# Altium project DEVEFX000001A.PrjPcb (part 2 of 2)

## Sheet 18_PWR_INPUT.SchDoc
size A3; DocumentNumber: 18; SheetNumber: 18; SheetTotal: 21
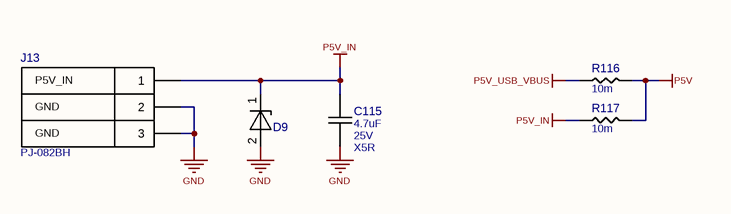
[diagram p17: 18_PWR_INPUT.SchDoc]

### Parts
C115  4.7uF  Voltage: 25V  TempC: X5R  [CAPC1608X08N]
D9  ESD401DPYR  [DFN65P100X50-2N]  (value not drawn)
J13  PJ-082BH  [CUI_PJ-082BH]
R116  10m  [RESC2012X06N]
R117  10m  [RESC2012X06N]

### Nets
GND: C115.1 D9.2(A) J13.2 J13.3
P5V: R116.2 R117.2
P5V_IN: C115.2 D9.1(C) J13.1 R117.1
P5V_USB_VBUS: R116.1

### Notes on the sheet
- P5V_IN
- GND

### Library data of the parts
C115 = GRM188R61E475KE11D: CAP CER 4.7UF 25V X5R 0603; Manufacturer 1: Murata Electronics; Tol: 10%; Part Number: GRM188R61E475KE11D; Value: 4.7uF; Manufacturer Part Number 1: GRM188R61E475KE11D; Supplier 1: Digi-Key; Supplier Part Number 1: 490-7203-1-ND
D9 = ESD401DPYR: TVS DIODE 5.5V 24V 2X1SON; Manufacturer 1: Texas Instruments; Part Number: ESD401DPYR; Manufacturer Part Number 1: ESD401DPYR; Supplier 1: Digi-Key; Supplier Part Number 1: 296-47160-1-ND
J13 = PJ-082BH: CONN PWR JACK 2.5X5.5MM SOLDER; Manufacturer 1: CUI Devices; Part Number: PJ-082BH; Manufacturer Part Number 1: PJ-082BH; Supplier 1: Digi-Key; Supplier Part Number 1: CP-082BHTR-ND
R116 R117 = PF0805FRM7W0R01L: RES 0.01 OHM 1% 1/4W 0805; Manufacturer 1: Yageo; Part Number: PF0805FRM7W0R01L; Value: 10m; Tol: 1%; Manufacturer Part Number 1: PF0805FRM7W0R01L; Supplier 1: Digi-Key; Supplier Part Number 1: 311-0.01NUCT-ND

## Sheet 19_PWR_VRS.SchDoc
size A3; DocumentNumber: 19; SheetNumber: 19; SheetTotal: 21
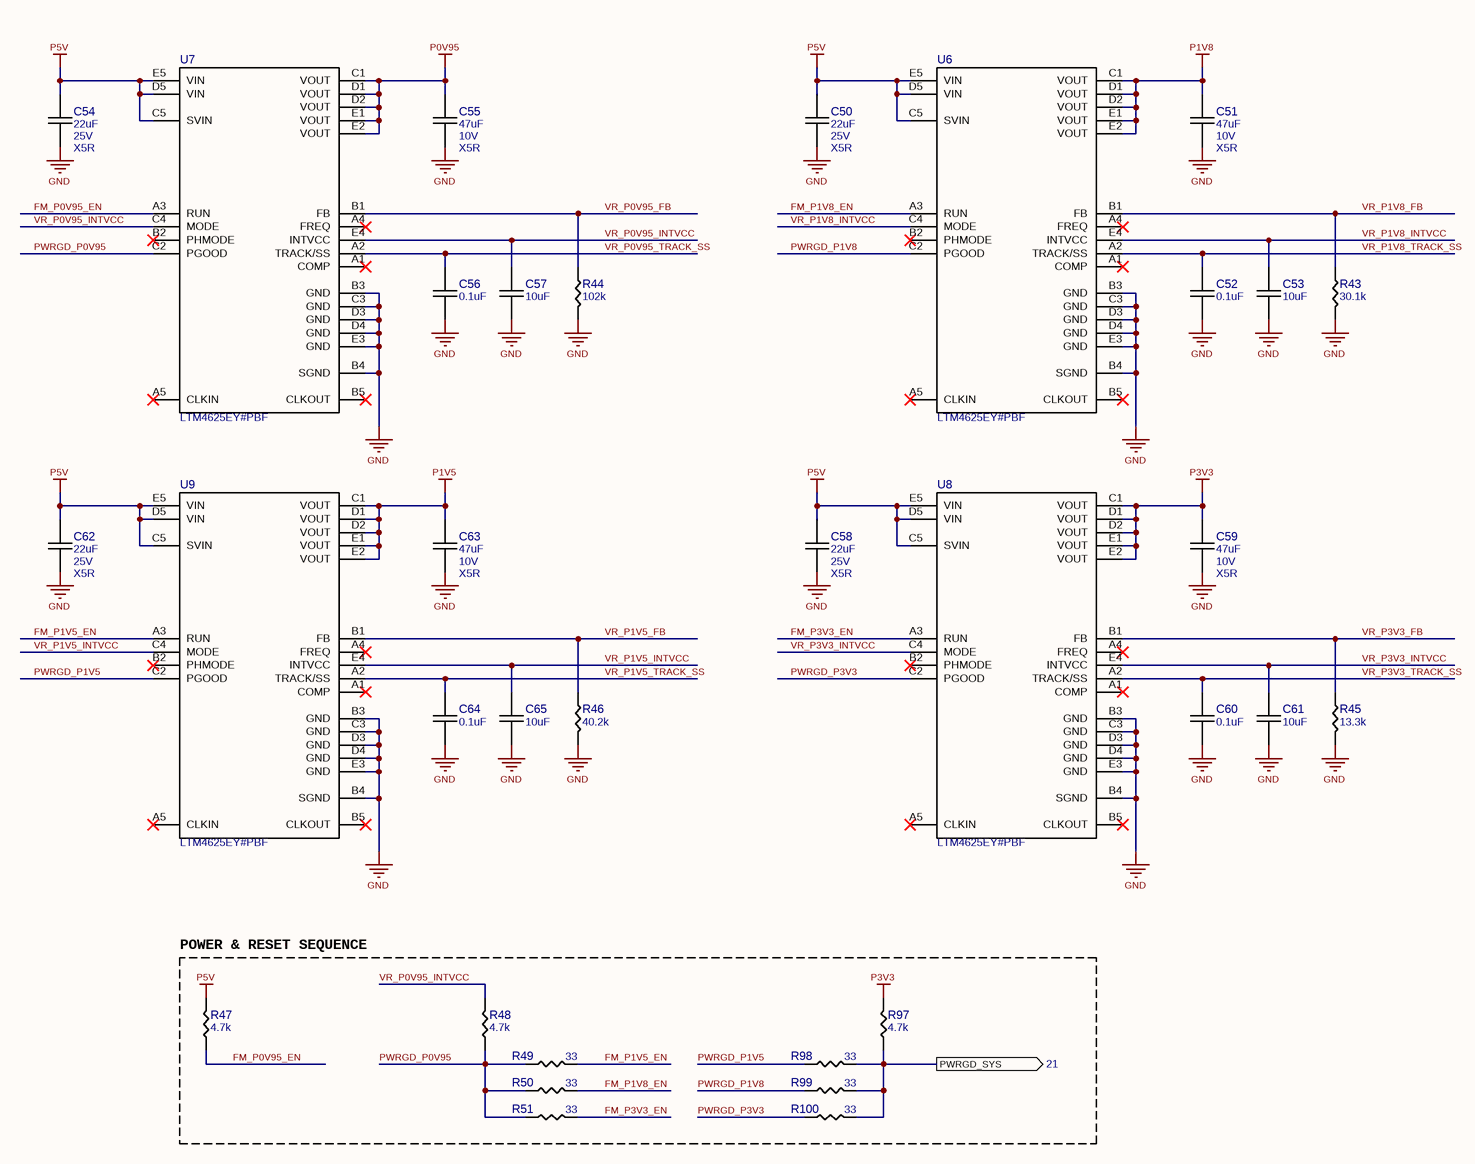
[diagram p18: 19_PWR_VRS.SchDoc]

### Parts
C50  22uF  Voltage: 25V  TempC: X5R  [CAPC2012X14N]
C51  47uF  Voltage: 10V  TempC: X5R  [CAPC2012X14N]
C52  0.1uF  [CAPC1005X06N]
C53  10uF  [CAPC1005X06N]
C54  22uF  Voltage: 25V  TempC: X5R  [CAPC2012X14N]
C55  47uF  Voltage: 10V  TempC: X5R  [CAPC2012X14N]
C56  0.1uF  [CAPC1005X06N]
C57  10uF  [CAPC1005X06N]
C58  22uF  Voltage: 25V  TempC: X5R  [CAPC2012X14N]
C59  47uF  Voltage: 10V  TempC: X5R  [CAPC2012X14N]
C60  0.1uF  [CAPC1005X06N]
C61  10uF  [CAPC1005X06N]
C62  22uF  Voltage: 25V  TempC: X5R  [CAPC2012X14N]
C63  47uF  Voltage: 10V  TempC: X5R  [CAPC2012X14N]
C64  0.1uF  [CAPC1005X06N]
C65  10uF  [CAPC1005X06N]
R43  30.1k  [RESC1005X03N]
R44  102k  [RESC1005X03N]
R45  13.3k  [RESC1005X03N]
R46  40.2k  [RESC1005X03N]
R47  4.7k  [RESC1005X03N]
R48  4.7k  [RESC1005X03N]
R49  33  [RESC1005X03N]
R50  33  [RESC1005X03N]
R51  33  [RESC1005X03N]
R97  4.7k  [RESC1005X03N]
R98  33  [RESC1005X03N]
R99  33  [RESC1005X03N]
R100  33  [RESC1005X03N]
U6  LTM4625EY#PBF  [BGA25C127P5X5_625X625X521]
U7  LTM4625EY#PBF  [BGA25C127P5X5_625X625X521]
U8  LTM4625EY#PBF  [BGA25C127P5X5_625X625X521]
U9  LTM4625EY#PBF  [BGA25C127P5X5_625X625X521]

### Blocks framed on the sheet
POWER & RESET SEQUENCE: R47-R51 R97-R100

### Ports
PWRGD_SYS (out, see 21)

### Nets
GND: C50.1 C51.1 C52.1 C53.1 C54.1 C55.1 C56.1 C57.1 C58.1 C59.1 C60.1 C61.1 C62.1 C63.1 C64.1 C65.1 R43.2 R44.2 R45.2 R46.2 U6.B3(GND) U6.B4(SGND) U6.C3(GND) U6.D3(GND) U6.D4(GND) U6.E3(GND) U7.B3(GND) U7.B4(SGND) U7.C3(GND) U7.D3(GND) U7.D4(GND) U7.E3(GND) U8.B3(GND) U8.B4(SGND) U8.C3(GND) U8.D3(GND) U8.D4(GND) U8.E3(GND) U9.B3(GND) U9.B4(SGND) U9.C3(GND) U9.D3(GND) U9.D4(GND) U9.E3(GND)
P0V95: C55.2 U7.C1(VOUT) U7.D1(VOUT) U7.D2(VOUT) U7.E1(VOUT) U7.E2(VOUT)
P1V5: C63.2 U9.C1(VOUT) U9.D1(VOUT) U9.D2(VOUT) U9.E1(VOUT) U9.E2(VOUT)
P1V8: C51.2 U6.C1(VOUT) U6.D1(VOUT) U6.D2(VOUT) U6.E1(VOUT) U6.E2(VOUT)
P3V3: C59.2 R97.2 U8.C1(VOUT) U8.D1(VOUT) U8.D2(VOUT) U8.E1(VOUT) U8.E2(VOUT)
P5V: C50.2 C54.2 C58.2 C62.2 R47.2 U6.C5(SVIN) U6.D5(VIN) U6.E5(VIN) U7.C5(SVIN) U7.D5(VIN) U7.E5(VIN) U8.C5(SVIN) U8.D5(VIN) U8.E5(VIN) U9.C5(SVIN) U9.D5(VIN) U9.E5(VIN)
FM_P0V95_EN: R47.1 U7.A3(RUN)
FM_P1V5_EN: R49.2 U9.A3(RUN)
FM_P1V8_EN: R50.2 U6.A3(RUN)
FM_P3V3_EN: R51.2 U8.A3(RUN)
PWRGD_P0V95: R48.1 R49.1 R50.1 R51.1 U7.C2(PGOOD)
PWRGD_P1V5: R98.1 U9.C2(PGOOD)
PWRGD_P1V8: R99.1 U6.C2(PGOOD)
PWRGD_P3V3: R100.1 U8.C2(PGOOD)
PWRGD_SYS: R97.1 R98.2 R99.2 R100.2 ; port PWRGD_SYS
VR_P0V95_FB: R44.1 U7.B1(FB)
VR_P0V95_INTVCC: C57.2 R48.2 U7.C4(MODE) U7.E4(INTVCC)
VR_P0V95_TRACK_SS: C56.2 U7.A2(TRACK/SS)
VR_P1V5_FB: R46.1 U9.B1(FB)
VR_P1V5_INTVCC: C65.2 U9.C4(MODE) U9.E4(INTVCC)
VR_P1V5_TRACK_SS: C64.2 U9.A2(TRACK/SS)
VR_P1V8_FB: R43.1 U6.B1(FB)
VR_P1V8_INTVCC: C53.2 U6.C4(MODE) U6.E4(INTVCC)
VR_P1V8_TRACK_SS: C52.2 U6.A2(TRACK/SS)
VR_P3V3_FB: R45.1 U8.B1(FB)
VR_P3V3_INTVCC: C61.2 U8.C4(MODE) U8.E4(INTVCC)
VR_P3V3_TRACK_SS: C60.2 U8.A2(TRACK/SS)

Not connected (* = marked no-connect by the designer): U6 A1(COMP)* A4(FREQ)* A5(CLKIN)* B2(PHMODE)* B5(CLKOUT)*; U7 A1(COMP)* A4(FREQ)* A5(CLKIN)* B2(PHMODE)* B5(CLKOUT)*; U8 A1(COMP)* A4(FREQ)* A5(CLKIN)* B2(PHMODE)* B5(CLKOUT)*; U9 A1(COMP)* A4(FREQ)* A5(CLKIN)* B2(PHMODE)* B5(CLKOUT)*

### Library data of the parts
C50 C54 C58 C62 = GRM21BR61E226ME44L: CAP CER 22UF 25V X5R 0805; Manufacturer 1: Murata Electronics; Tol: 20%; Part Number: GRM21BR61E226ME44L; Value: 22uF; Manufacturer Part Number 1: GRM21BR61E226ME44L; Supplier 1: Digi-Key; Supplier Part Number 1: 490-10749-1-ND
C51 C55 C59 C63 = GRM21BR61A476ME15L: CAP CER 47UF 10V X5R 0805; Manufacturer 1: Murata Electronics; Tol: 20%; Part Number: GRM21BR61A476ME15L; Value: 47uF; Manufacturer Part Number 1: GRM21BR61A476ME15L; Supplier 1: Digi-Key; Supplier Part Number 1: 490-9961-1-ND
C52 C56 C60 C64 = GRM155R71E104KE14J: as C25 on sheet 13_IO_ETH; Part Number: GRM155R71E104KE14J; Value: 0.1uF; Voltage: 25V; TempC: X7R; Manufacturer Part Number 1: GRM155R71E104KE14J; Supplier 1: Digi-Key; Supplier Part Number 1: 490-14603-1-ND
C53 C57 C61 C65 = GRM155R60J106ME47D: CAP CER 10UF 6.3V X5R 0402; Manufacturer 1: Murata Electronics; Tol: 20%; Part Number: GRM155R60J106ME47D; Value: 10uF; Voltage: 6.3V; TempC: X5R; Manufacturer Part Number 1: GRM155R60J106ME47D; Supplier 1: Digi-Key; Supplier Part Number 1: 490-13239-1-ND
R43 = RC0402FR-0730K1L: RES 30.1K OHM 1% 1/16W 0402; Manufacturer 1: Yageo; Part Number: RC0402FR-0730K1L; Value: 30.1k; Tol: 1%; Manufacturer Part Number 1: RC0402FR-0730K1L; Supplier 1: Digi-Key; Supplier Part Number 1: 311-30.1KLRCT-ND
R44 = RC0402FR-07102KL: RES SMD 102K OHM 1% 1/16W 0402; Manufacturer 1: Yageo; Part Number: RC0402FR-07102KL; Value: 102k; Tol: 1%; Manufacturer Part Number 1: RC0402FR-07102KL; Supplier 1: Digi-Key; Supplier Part Number 1: YAG2944CT-ND
R45 = RC0402FR-0713K3L: RES 13.3K OHM 1% 1/16W 0402; Manufacturer 1: Yageo; Part Number: RC0402FR-0713K3L; Value: 13.3k; Tol: 1%; Manufacturer Part Number 1: RC0402FR-0713K3L; Supplier 1: Digi-Key; Supplier Part Number 1: YAG2974CT-ND
R46 = RC0402FR-0740K2L: RES 40.2K OHM 1% 1/16W 0402; Manufacturer 1: Yageo; Part Number: RC0402FR-0740K2L; Value: 40.2k; Tol: 1%; Manufacturer Part Number 1: RC0402FR-0740K2L; Supplier 1: Digi-Key; Supplier Part Number 1: 311-40.2KLRCT-ND
R47 R48 R97 = RC0402FR-074K7L: as R55 on sheet 12_MEM_DDR3; Part Number: RC0402FR-074K7L; Value: 4.7k; Tol: 1%; Manufacturer Part Number 1: RC0402FR-074K7L; Supplier 1: Digi-Key; Supplier Part Number 1: 311-4.7KLRCT-ND
R49-R51 R98-R100 = RC0402FR-0733RL: as R62 on sheet 05_FPGA_HVIO; Part Number: RC0402FR-0733RL; Value: 33; Tol: 1%; Manufacturer Part Number 1: RC0402FR-0733RL; Supplier 1: Digi-Key; Supplier Part Number 1: 311-33.0LRCT-ND
U6-U9 = LTM4625EY#PBF: DC DC CONVERTER 0.6-5.5V; Manufacturer 1: Analog Devices Inc.; Part Number: LTM4625EY#PBF; Manufacturer Part Number 1: LTM4625EY#PBF; Supplier 1: Digi-Key; Supplier Part Number 1: 505-LTM4625EY#PBF-ND

## Sheet 20_CLOCKS.SchDoc
size A3; DocumentNumber: 20; SheetNumber: 20; SheetTotal: 21
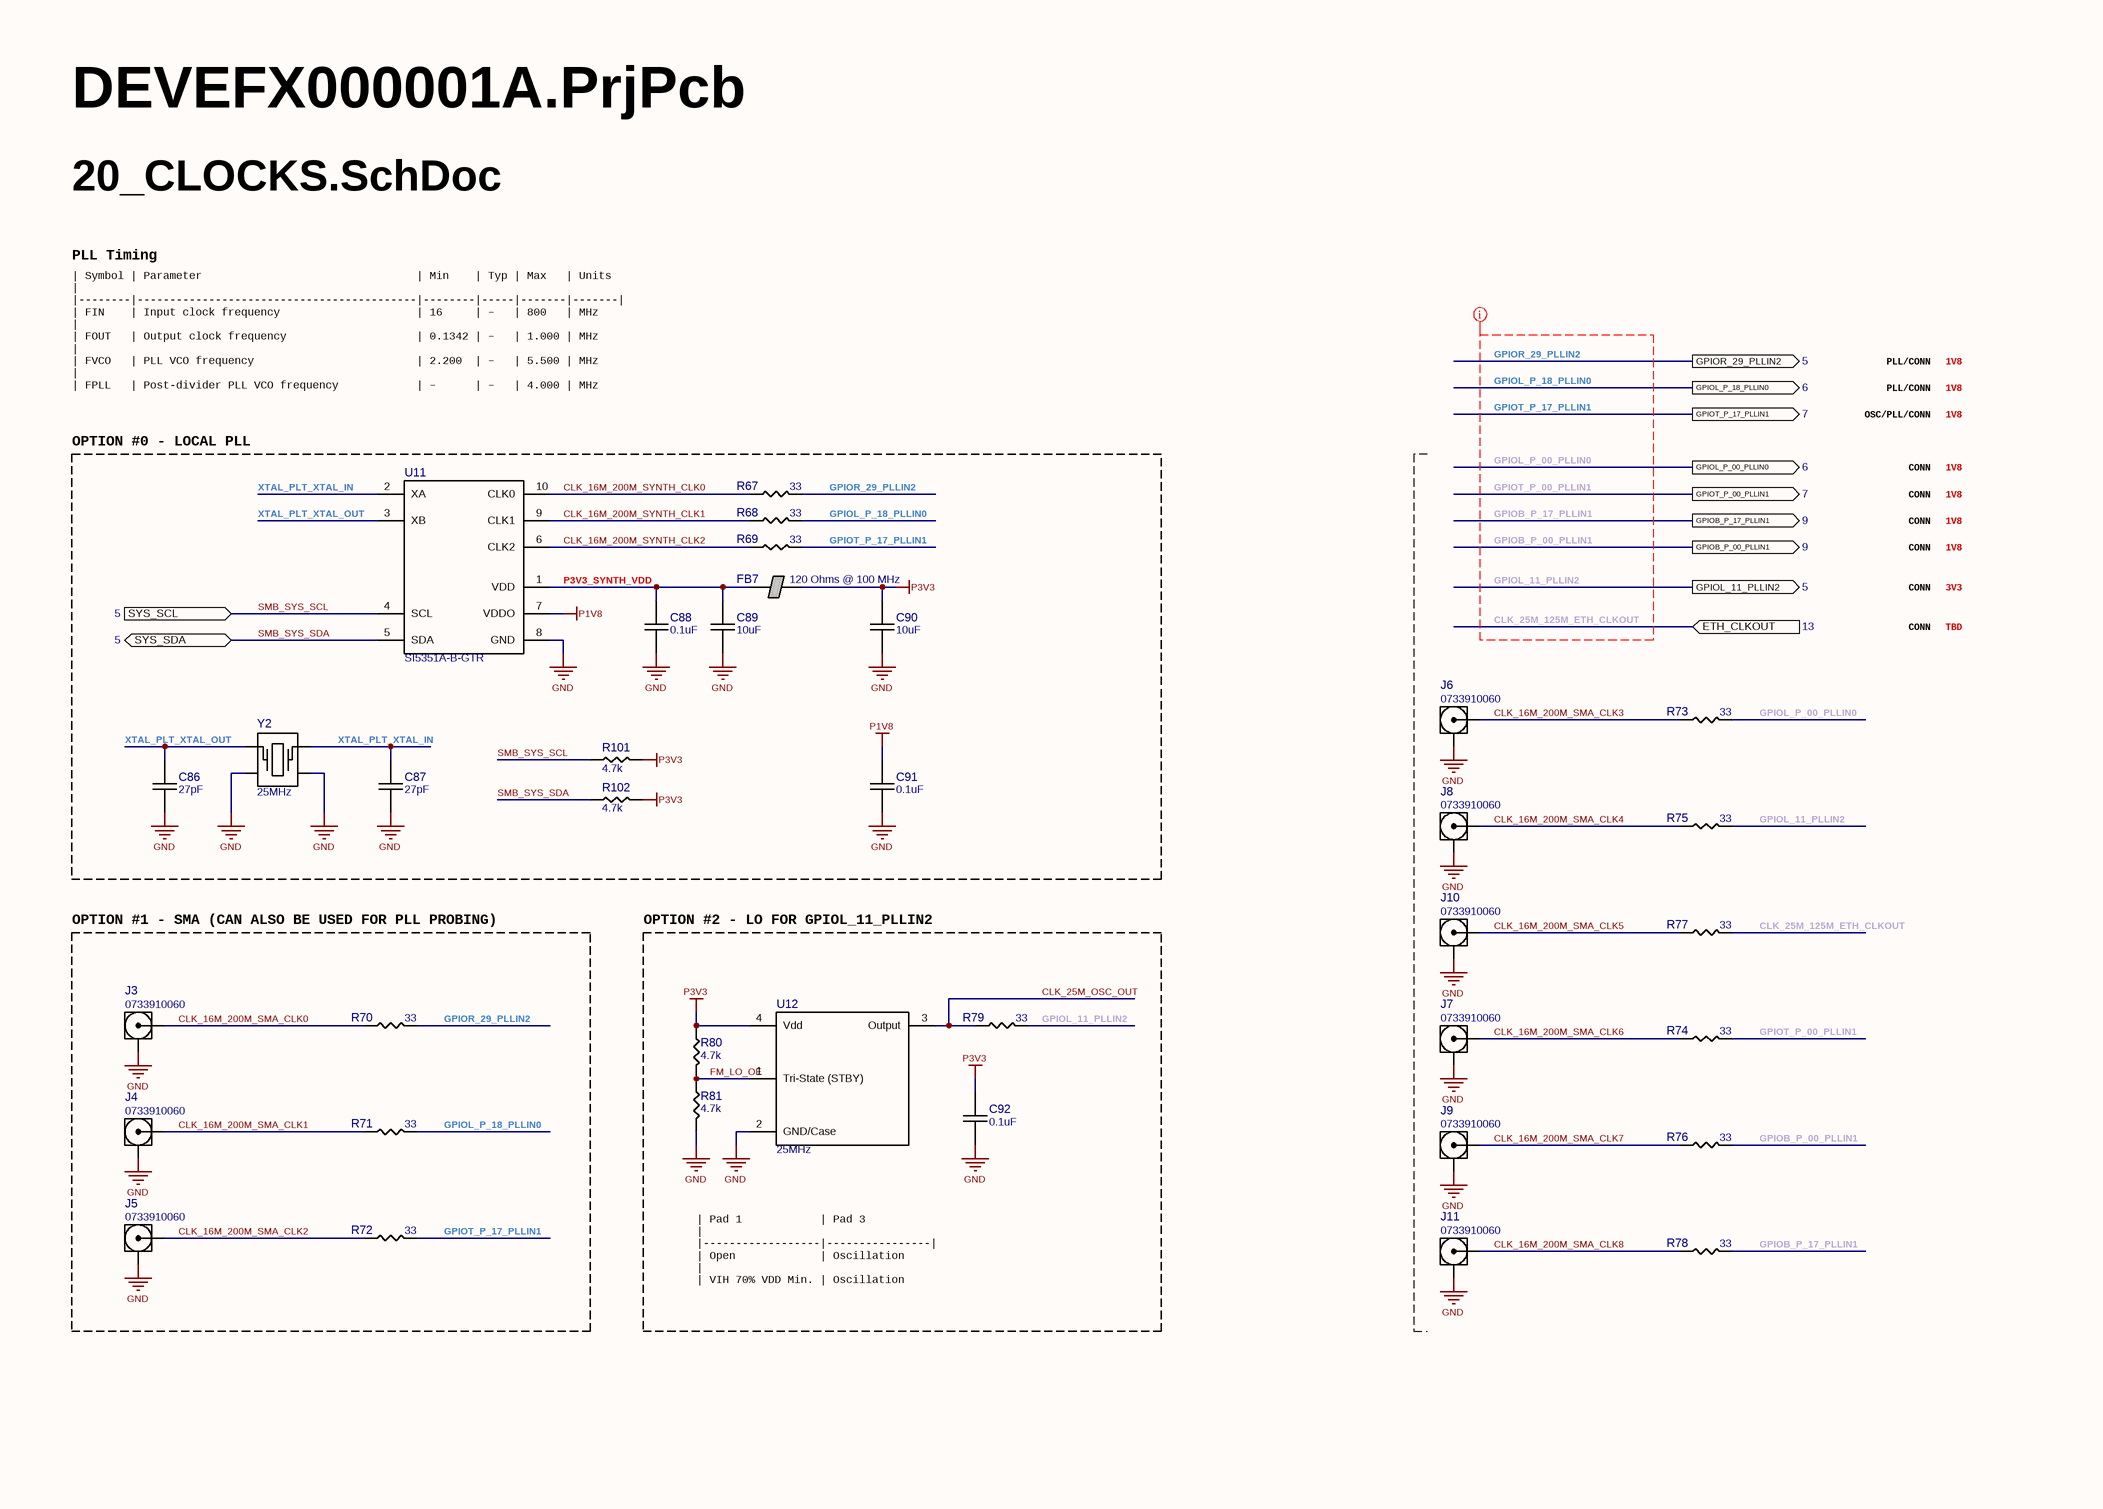
[diagram p19: 20_CLOCKS.SchDoc]

### Parts
C86  27pF  [CAPC1005X06N]
C87  27pF  [CAPC1005X06N]
C88  0.1uF  [CAPC1005X06N]
C89  10uF  [CAPC1005X06N]
C90  10uF  [CAPC1005X06N]
C91  0.1uF  [CAPC1005X06N]
C92  0.1uF  [CAPC1005X06N]
FB7  120 Ohms @ 100 MHz  [INDC1005X05N]
J3  0733910060  [MOLEX_0733910060]
J4  0733910060  [MOLEX_0733910060]
J5  0733910060  [MOLEX_0733910060]
J6  0733910060  [MOLEX_0733910060]
J7  0733910060  [MOLEX_0733910060]
J8  0733910060  [MOLEX_0733910060]
J9  0733910060  [MOLEX_0733910060]
J10  0733910060  [MOLEX_0733910060]
J11  0733910060  [MOLEX_0733910060]
R67  33  [RESC1005X03N]
R68  33  [RESC1005X03N]
R69  33  [RESC1005X03N]
R70  33  [RESC1005X03N]
R71  33  [RESC1005X03N]
R72  33  [RESC1005X03N]
R73  33  [RESC1005X03N]
R74  33  [RESC1005X03N]
R75  33  [RESC1005X03N]
R76  33  [RESC1005X03N]
R77  33  [RESC1005X03N]
R78  33  [RESC1005X03N]
R79  33  [RESC1005X03N]
R80  4.7k  [RESC1005X03N]
R81  4.7k  [RESC1005X03N]
R101  4.7k  [RESC1005X03N]
R102  4.7k  [RESC1005X03N]
U11  SI5351A-B-GTR  [TSSOP50P490X110-10N]
U12  25MHz  [XTAL_2520]
Y2  25MHz  [XTAL_3225]

### Blocks framed on the sheet
OPTION #0 - LOCAL PLL: C86-C91 FB7 R67-R69 R101 R102 U11 Y2
OPTION #1 - SMA (CAN ALSO BE USED FOR PLL PROBING): J3-J5 R70-R72
OPTION #2 - LO FOR GPIOL_11_PLLIN2: C92 R79-R81 U12

### Ports
ETH_CLKOUT (in, see 13), GPIOB_P_00_PLLIN1 (out, see 9), GPIOB_P_17_PLLIN1 (out, see 9), GPIOL_11_PLLIN2 (out, see 5), GPIOL_P_00_PLLIN0 (out, see 6), GPIOL_P_18_PLLIN0 (out, see 6), GPIOR_29_PLLIN2 (out, see 5), GPIOT_P_00_PLLIN1 (out, see 7), GPIOT_P_17_PLLIN1 (out, see 7), SYS_SCL (in, see 5), SYS_SDA (bidir, see 5)

### Nets
GND: C86.1 C87.1 C88.1 C89.1 C90.1 C91.1 C92.1 J3.2 J4.2 J5.2 J6.2 J7.2 J8.2 J9.2 J10.2 J11.2 R81.2 U11.8(GND) U12.2(GND/Case) Y2.2 Y2.4
P1V8: C91.2 U11.7(VDDO)
P3V3: C90.2 C92.2 FB7.2 R80.1 R101.2 R102.2 U12.4(Vdd)
CLK_16M_200M_SMA_CLK0: J3.1 R70.1
CLK_16M_200M_SMA_CLK1: J4.1 R71.1
CLK_16M_200M_SMA_CLK2: J5.1 R72.1
CLK_16M_200M_SMA_CLK3: J6.1 R73.1
CLK_16M_200M_SMA_CLK4: J8.1 R75.1
CLK_16M_200M_SMA_CLK5: J10.1 R77.1
CLK_16M_200M_SMA_CLK6: J7.1 R74.1
CLK_16M_200M_SMA_CLK7: J9.1 R76.1
CLK_16M_200M_SMA_CLK8: J11.1 R78.1
CLK_16M_200M_SYNTH_CLK0: R67.1 U11.10(CLK0)
CLK_16M_200M_SYNTH_CLK1: R68.1 U11.9(CLK1)
CLK_16M_200M_SYNTH_CLK2: R69.1 U11.6(CLK2)
CLK_25M_125M_ETH_CLKOUT: R77.2 ; port ETH_CLKOUT
CLK_25M_OSC_OUT: R79.1 U12.3(Output)
FM_LO_OE: R80.2 R81.1 U12.1(Tri-State_(STBY))
GPIOB_P_00_PLLIN1: R76.2 ; port GPIOB_P_00_PLLIN1
GPIOB_P_17_PLLIN1: R78.2 ; port GPIOB_P_17_PLLIN1
GPIOL_11_PLLIN2: R75.2 R79.2 ; port GPIOL_11_PLLIN2
GPIOL_P_00_PLLIN0: R73.2 ; port GPIOL_P_00_PLLIN0
GPIOL_P_18_PLLIN0: R68.2 R71.2 ; port GPIOL_P_18_PLLIN0
GPIOR_29_PLLIN2: R67.2 R70.2 ; port GPIOR_29_PLLIN2
GPIOT_P_00_PLLIN1: R74.2 ; port GPIOT_P_00_PLLIN1
GPIOT_P_17_PLLIN1: R69.2 R72.2 ; port GPIOT_P_17_PLLIN1
P3V3_SYNTH_VDD: C88.2 C89.2 FB7.1 U11.1(VDD)
SMB_SYS_SCL: R101.1 U11.4(SCL) ; port SYS_SCL
SMB_SYS_SDA: R102.1 U11.5(SDA) ; port SYS_SDA
XTAL_PLT_XTAL_IN: C87.2 U11.2(XA) Y2.3
XTAL_PLT_XTAL_OUT: C86.2 U11.3(XB) Y2.1

### Layout directives
net class CLK: CLK_25M_125M_ETH_CLKOUT, GPIOB_P_00_PLLIN1, GPIOB_P_17_PLLIN1, GPIOL_11_PLLIN2, GPIOL_P_00_PLLIN0, GPIOL_P_18_PLLIN0, GPIOR_29_PLLIN2, GPIOT_P_00_PLLIN1, GPIOT_P_17_PLLIN1

### Notes on the sheet
- PLL Timing
- | Symbol | Parameter                                 | Min    | Typ | Max   | Units |
  |--------|-------------------------------------------|--------|-----|-------|-------|
  | FIN    | Input clock frequency                     | 16     | –   | 800   | MHz   |
  | FOUT   | Output clock frequency                    | 0.1342 | –   | 1.000 | MHz   |
  | FVCO   | PLL VCO frequency                         | 2.200  | –   | 5.500 | MHz   |
  | FPLL   | Post-divider PLL VCO frequency            | –      | –   | 4.000 | MHz   |
  | FPFD   | Phase frequency detector input frequency  | 16     | –   | 800   | MHz   |
- PLL/CONN
- 1V8
- OSC/PLL/CONN
- CONN
- 3V3
- TBD
- | Pad 1            | Pad 3          |
  |------------------|----------------|
  | Open             | Oscillation    |
  | VIH 70% VDD Min. | Oscillation    |
  | VIL 30% VDD Max. | No Oscillation |

### Library data of the parts
C86 C87 = CC0402JRNPO9BN270: CAP CER 27PF 50V C0G/NPO 0402; Manufacturer 1: Yageo; Tol: 5%; TempC: C0G/NP0; Part Number: CC0402JRNPO9BN270; Value: 27pF; Voltage: 50V; Manufacturer Part Number 1: CC0402JRNPO9BN270; Supplier 1: Digi-Key; Supplier Part Number 1: 311-1019-1-ND
C88 C91 C92 = GRM155R71E104KE14J: as C25 on sheet 13_IO_ETH; Part Number: GRM155R71E104KE14J; Value: 0.1uF; Voltage: 25V; TempC: X7R; Manufacturer Part Number 1: GRM155R71E104KE14J; Supplier 1: Digi-Key; Supplier Part Number 1: 490-14603-1-ND
C89 C90 = GRM155R60J106ME47D: as C53 on sheet 19_PWR_VRS; Part Number: GRM155R60J106ME47D; Value: 10uF; Voltage: 6.3V; TempC: X5R; Manufacturer Part Number 1: GRM155R60J106ME47D; Supplier 1: Digi-Key; Supplier Part Number 1: 490-13239-1-ND
FB7 = BLM15PD121SN1D: FERRITE BEAD 120 OHM 0402 1LN; Manufacturer 1: Murata Electronics; DCR: 90mOhm; Ir: 1.3A; Part Number: BLM15PD121SN1D; Value: 120 Ohms @ 100 MHz; Manufacturer Part Number 1: BLM15PD121SN1D; Supplier 1: Digi-Key; Supplier Part Number 1: 490-5203-1-ND
J3-J11 = 0733910060: CONN SMA RCPT STR 50 OHM PCB; Manufacturer 1: Molex; Part Number: 0733910060; Manufacturer Part Number 1: 0733910060; Supplier 1: Digi-Key; Supplier Part Number 1: WM5543-ND
R67-R79 = RC0402FR-0733RL: as R62 on sheet 05_FPGA_HVIO; Part Number: RC0402FR-0733RL; Value: 33; Tol: 1%; Manufacturer Part Number 1: RC0402FR-0733RL; Supplier 1: Digi-Key; Supplier Part Number 1: 311-33.0LRCT-ND
R80 R81 R101 R102 = RC0402FR-074K7L: as R55 on sheet 12_MEM_DDR3; Part Number: RC0402FR-074K7L; Value: 4.7k; Tol: 1%; Manufacturer Part Number 1: RC0402FR-074K7L; Supplier 1: Digi-Key; Supplier Part Number 1: 311-4.7KLRCT-ND
U11 = SI5351A-B-GTR: IC CLK GENERATOR 200MHZ 10MSOP; Manufacturer 1: Skyworks Solutions Inc.; Part Number: SI5351A-B-GTR; Manufacturer Part Number 1: SI5351A-B-GTR; Supplier 1: Digi-Key; Supplier Part Number 1: 336-3908-1-ND
U12 = ECS-2033-250-BN: XTAL OSC XO 25.0000MHZ CMOS SMD; Manufacturer 1: ECS Inc.; Part Number: ECS-2033-250-BN; Value: 25MHz; Manufacturer Part Number 1: ECS-2033-250-BN; Supplier 1: Digi-Key; Supplier Part Number 1: XC1433CT-ND
Y2 = TSX-3225 25.0000MF10P-C0: CRYSTAL 25.0000MHZ 18PF SMD; Manufacturer 1: EPSON; Part Number: TSX-3225 25.0000MF10P-C0; Value: 25MHz; Manufacturer Part Number 1: TSX-3225 25.0000MF10P-C0; Supplier 1: Digi-Key; Supplier Part Number 1: SER4211TR-ND

## Sheet 21_RESET_MISC.SchDoc
size A3; DocumentNumber: 21; SheetNumber: 21; SheetTotal: 21
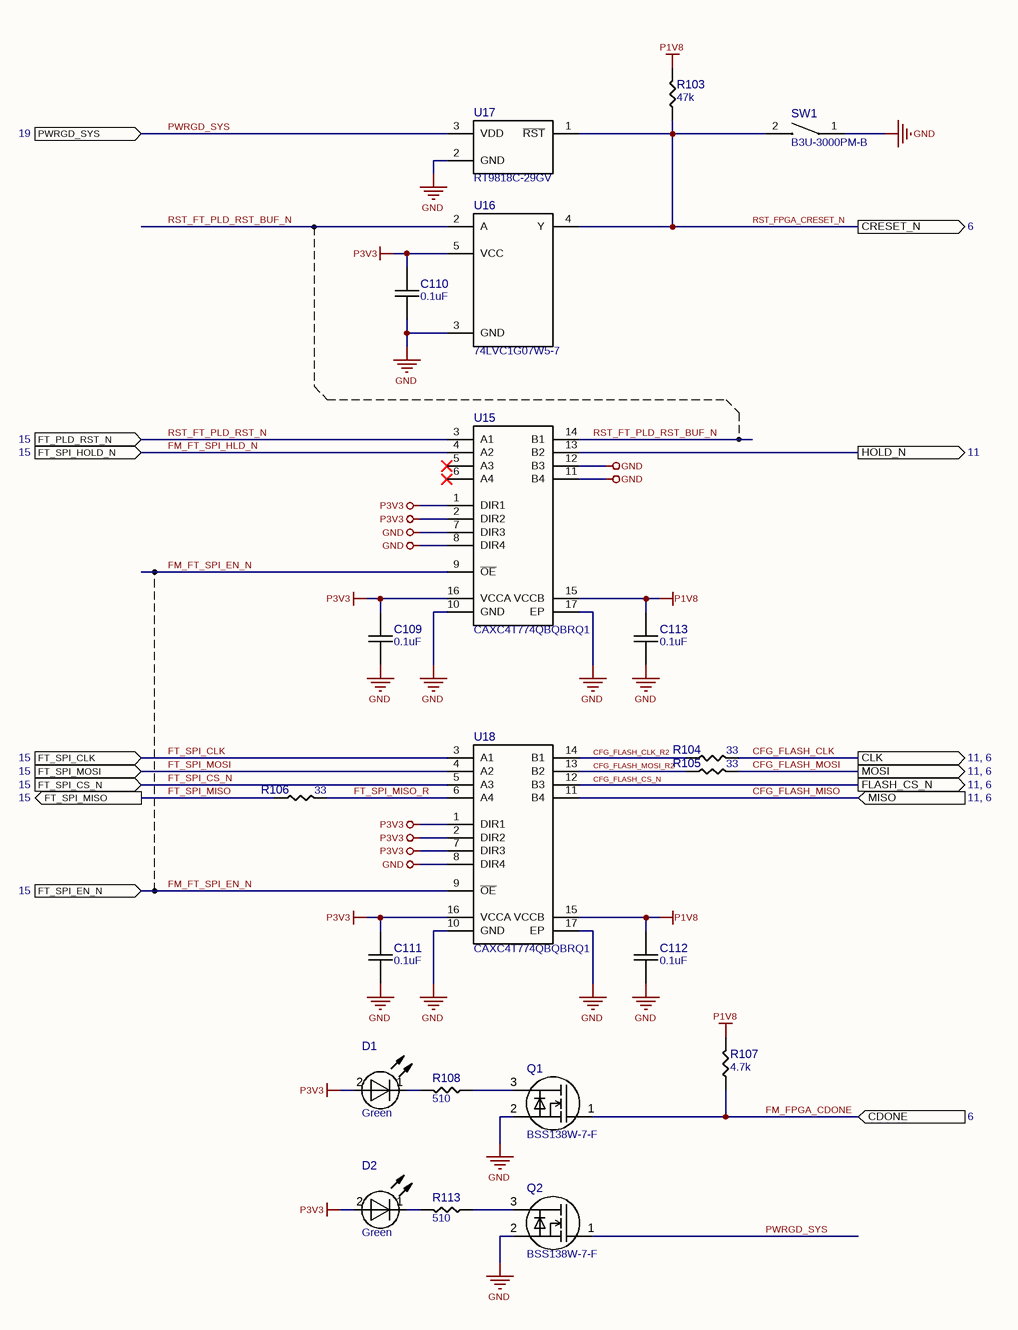
[diagram p20: 21_RESET_MISC.SchDoc]

### Parts
C109  0.1uF  [CAPC1005X06N]
C110  0.1uF  [CAPC1005X06N]
C111  0.1uF  [CAPC1005X06N]
C112  0.1uF  [CAPC1005X06N]
C113  0.1uF  [CAPC1005X06N]
D1  Green  [LED1608]
D2  Green  [LED1608]
Q1  BSS138W-7-F  [SOT65P205X100-3N]
Q2  BSS138W-7-F  [SOT65P205X100-3N]
R103  47k  [RESC1005X03N]
R104  33  [RESC1005X03N]
R105  33  [RESC1005X03N]
R106  33  [RESC1005X03N]
R107  4.7k  [RESC1005X03N]
R108  510  [RESC1005X03N]
R113  510  [RESC1005X03N]
SW1  B3U-3000PM-B  [B3U-3000P(M)-B]
U15  CAXC4T774QBQBRQ1
U16  74LVC1G07W5-7  [SOT95P280X145-5N]
U17  RT9818C-29GV  [SOT95P230X110-3N]
U18  CAXC4T774QBQBRQ1

### Ports
CDONE (in, see 6), CLK (out, see 11, 6), CRESET_N (out, see 6), FLASH_CS_N (out, see 11, 6), FT_PLD_RST_N (in, see 15), FT_SPI_CLK (in, see 15), FT_SPI_CS_N (in, see 15), FT_SPI_EN_N (in, see 15), FT_SPI_HOLD_N (in, see 15), FT_SPI_MISO (out, see 15), FT_SPI_MOSI (in, see 15), HOLD_N (out, see 11), MISO (in, see 11, 6), MOSI (out, see 11, 6), PWRGD_SYS (in, see 19)

### Nets
GND: C109.1 C110.1 C111.1 C112.1 C113.1 Q1.2(S) Q2.2(S) SW1.1 U15.7(DIR3) U15.8(DIR4) U15.10(GND) U15.11(B4) U15.12(B3) U15.17(EP) U16.3(GND) U17.2(GND) U18.8(DIR4) U18.10(GND) U18.17(EP)
P1V8: C112.2 C113.2 R103.2 R107.2 U15.15(VCCB) U18.15(VCCB)
P3V3: C109.2 C110.2 C111.2 D1.2(A) D2.2(A) U15.1(DIR1) U15.2(DIR2) U15.16(VCCA) U16.5(VCC) U18.1(DIR1) U18.2(DIR2) U18.7(DIR3) U18.16(VCCA)
CFG_FLASH_CLK: R104.2 ; port CLK
CFG_FLASH_CLK_R2: R104.1 U18.14(B1)
CFG_FLASH_CS_N: U18.12(B3) ; port FLASH_CS_N
CFG_FLASH_MISO: U18.11(B4) ; port MISO
CFG_FLASH_MOSI: R105.2 ; port MOSI
CFG_FLASH_MOSI_R2: R105.1 U18.13(B2)
FM_CFG_FLASH_HOLD_N: U15.13(B2) ; port HOLD_N
FM_FPGA_CDONE: Q1.1(G) R107.1 ; port CDONE
FM_FT_SPI_EN_N: U15.9(~{OE}) U18.9(~{OE}) ; port FT_SPI_EN_N
FM_FT_SPI_HLD_N: U15.4(A2) ; port FT_SPI_HOLD_N
FT_SPI_CLK: U18.3(A1) ; port FT_SPI_CLK
FT_SPI_CS_N: U18.5(A3) ; port FT_SPI_CS_N
FT_SPI_MISO: R106.1 ; port FT_SPI_MISO
FT_SPI_MISO_R: R106.2 U18.6(A4)
FT_SPI_MOSI: U18.4(A2) ; port FT_SPI_MOSI
PWRGD_SYS: Q2.1(G) U17.3(VDD) ; port PWRGD_SYS
RST_FPGA_CRESET_N: R103.1 SW1.2 U16.4(Y) U17.1(~{RST}) ; port CRESET_N
RST_FT_PLD_RST_BUF_N: U15.14(B1) U16.2(A)
RST_FT_PLD_RST_N: U15.3(A1) ; port FT_PLD_RST_N
NetD1_1: D1.1(C) R108.2
NetD2_1: D2.1(C) R113.2
NetQ1_3: Q1.3(D) R108.1
NetQ2_3: Q2.3(D) R113.1

Not connected (* = marked no-connect by the designer): U15 5(A3)* 6(A4)*

### Library data of the parts
C109-C113 = GRM155R71E104KE14J: CAP CER 0.1UF 25V X7R 0402; Manufacturer 1: Murata Electronics; Tol: 10%; Part Number: GRM155R71E104KE14J; Value: 0.1uF; Voltage: 25V; TempC: X7R; Manufacturer Part Number 1: GRM155R71E104KE14J; Supplier 1: Digi-Key; Supplier Part Number 1: 490-14603-1-ND
D1 D2 = APT1608SGC: LED GREEN CLEAR CHIP SMD; Manufacturer 1: Kingbright; Part Number: APT1608SGC; Manufacturer Part Number 1: APT1608SGC; Supplier 1: Digi-Key; Supplier Part Number 1: 754-1121-1-ND
Q1 Q2 = BSS138W-7-F: MOSFET N-CH 50V 200MA SOT323; Manufacturer 1: Diodes Incorporated; Part Number: BSS138W-7-F; Manufacturer Part Number 1: BSS138W-7-F; Supplier 1: Digi-Key; Supplier Part Number 1: BSS138W-FDICT-ND
R103 = RC0402FR-0747KL: RES SMD 47K OHM 1% 1/16W 0402; Manufacturer 1: Yageo; Part Number: RC0402FR-0747KL; Value: 47k; Tol: 1%; Manufacturer Part Number 1: RC0402FR-0747KL; Supplier 1: Digi-Key; Supplier Part Number 1: 311-47.0KLRCT-ND
R104-R106 = RC0402FR-0733RL: RES SMD 33 OHM 1% 1/16W 0402; Manufacturer 1: Yageo; Part Number: RC0402FR-0733RL; Value: 33; Tol: 1%; Manufacturer Part Number 1: RC0402FR-0733RL; Supplier 1: Digi-Key; Supplier Part Number 1: 311-33.0LRCT-ND
R107 = RC0402FR-074K7L: RES SMD 4.7K OHM 1% 1/16W 0402; Manufacturer 1: Yageo; Part Number: RC0402FR-074K7L; Value: 4.7k; Tol: 1%; Manufacturer Part Number 1: RC0402FR-074K7L; Supplier 1: Digi-Key; Supplier Part Number 1: 311-4.7KLRCT-ND
R108 R113 = RC0402JR-07510RL: RES 510 OHM 5% 1/16W 0402; Manufacturer 1: Yageo; Tol: 1%; Part Number: RC0402JR-07510RL; Value: 510; Manufacturer Part Number 1: RC0402JR-07510RL; Supplier 1: Digi-Key; Supplier Part Number 1: 311-510JRCT-ND
SW1 = B3U-3000PM-B: SWITCH TACTILE SPST-NO 0.05A 12V; Manufacturer 1: Omron Electronics Inc-EMC Div; Part Number: B3U-3000PM-B; Manufacturer Part Number 1: B3U-3000PM-B; Supplier 1: Digi-Key; Supplier Part Number 1: Z8276CT-ND
U15 U18 = CAXC4T774QBQBRQ1: AUTOMOTIVE 4-BIT 2-SUPPLY BUS TR; Manufacturer 1: Texas Instruments; Part Number: CAXC4T774QBQBRQ1; Manufacturer Part Number 1: CAXC4T774QBQBRQ1; Supplier 1: Digi-Key; Supplier Part Number 1: 296-CAXC4T774QBQBRQ1CT-ND
U16 = 74LVC1G07W5-7: IC BUFFER NON-INVERT 5.5V SOT25; Manufacturer 1: Diodes Incorporated; Part Number: 74LVC1G07W5-7; Manufacturer Part Number 1: 74LVC1G07W5-7; Supplier 1: Digi-Key; Supplier Part Number 1: 74LVC1G07W5-7DICT-ND
U17 = RT9818C-29GV: IC SUPERVISOR 1 CHANNEL SOT23-3; Manufacturer 1: Richtek USA Inc.; Part Number: RT9818C-29GV; Manufacturer Part Number 1: RT9818C-29GV; Supplier 1: Digi-Key; Supplier Part Number 1: 1028-1020-1-ND

## Nets that join several sheets
GND: 06_FPGA_HSIO_B1 (R1.2 R2.2), 07_FPGA_HSIO_B2 (R3.2 R4.2), 08_FPGA_HSIO_B3 (C85.1 R5.2 R6.2), 09_FPGA_HSIO_B4 (R7.2 R8.2), 10_FPGA_PWR (35 pins), 11_MEM_HYPERRAM_FLASH (9 pins), 12_MEM_DDR3 (38 pins), 13_IO_ETH (30 pins), 14_IO_MIPI (10 pins), 15_IO_USB (40 pins), 18_PWR_INPUT (C115.1 D9.2 J13.2 J13.3), 19_PWR_VRS (44 pins), 20_CLOCKS (21 pins), 21_RESET_MISC (19 pins)
P0V75_DDR3_VREF: 08_FPGA_HSIO_B3 (C85.2 U1.G15 U1.L15), 12_MEM_DDR3 (7 pins)
P0V95: 10_FPGA_PWR (16 pins), 19_PWR_VRS (6 pins)
P1V5: 10_FPGA_PWR (6 pins), 12_MEM_DDR3 (29 pins), 19_PWR_VRS (6 pins)
P1V8: 10_FPGA_PWR (26 pins), 11_MEM_HYPERRAM_FLASH (15 pins), 13_IO_ETH (6 pins), 19_PWR_VRS (6 pins), 20_CLOCKS (C91.2 U11.7), 21_RESET_MISC (6 pins)
P3V3: 10_FPGA_PWR (6 pins), 13_IO_ETH (6 pins), 14_IO_MIPI (C84.2 J2.22 R65.2 R66.2), 15_IO_USB (20 pins), 19_PWR_VRS (7 pins), 20_CLOCKS (7 pins), 21_RESET_MISC (13 pins)
P5V: 18_PWR_INPUT (R116.2 R117.2), 19_PWR_VRS (17 pins)
P5V_USB_VBUS: 15_IO_USB (7 pins), 18_PWR_INPUT (R116.1)
CAM_CK_N: 07_FPGA_HSIO_B2 (U1.A8), 14_IO_MIPI (J2.8)
CAM_CK_P: 07_FPGA_HSIO_B2 (U1.B8), 14_IO_MIPI (J2.9)
CAM_D0_N: 07_FPGA_HSIO_B2 (U1.F8), 14_IO_MIPI (J2.2)
CAM_D0_P: 07_FPGA_HSIO_B2 (U1.F7), 14_IO_MIPI (J2.3)
CAM_D1_N: 07_FPGA_HSIO_B2 (U1.C6), 14_IO_MIPI (J2.5)
CAM_D1_P: 07_FPGA_HSIO_B2 (U1.B6), 14_IO_MIPI (J2.6)
CAM_D2_N: 07_FPGA_HSIO_B2 (U1.C9), 14_IO_MIPI (J2.11)
CAM_D2_P: 07_FPGA_HSIO_B2 (U1.C8), 14_IO_MIPI (J2.12)
CAM_D3_N: 07_FPGA_HSIO_B2 (U1.D10), 14_IO_MIPI (J2.14)
CAM_D3_P: 07_FPGA_HSIO_B2 (U1.C10), 14_IO_MIPI (J2.15)
CAM_LED: 05_FPGA_HVIO (U1.A13), 14_IO_MIPI (J2.18 R64.1)
CAM_PWREN: 05_FPGA_HVIO (U1.B12), 14_IO_MIPI (J2.17 R63.1)
CFG_FLASH_CLK: 06_FPGA_HSIO_B1 (R9.1), 11_MEM_HYPERRAM_FLASH (R15.1 U3.6), 21_RESET_MISC (R104.2)
CFG_FLASH_CS_N: 06_FPGA_HSIO_B1 (U1.P1), 11_MEM_HYPERRAM_FLASH (R16.1 U3.1), 21_RESET_MISC (U18.12)
CFG_FLASH_MISO: 06_FPGA_HSIO_B1 (R11.1), 11_MEM_HYPERRAM_FLASH (R13.1 U3.2), 21_RESET_MISC (U18.11)
CFG_FLASH_MOSI: 06_FPGA_HSIO_B1 (R17.1), 11_MEM_HYPERRAM_FLASH (R10.1 U3.5), 21_RESET_MISC (R105.2)
CLK_25M_125M_ETH_CLKOUT: 13_IO_ETH (R39.1), 20_CLOCKS (R77.2)
DDR3_A0: 08_FPGA_HSIO_B3 (U1.J12), 12_MEM_DDR3 (U10.K3)
DDR3_A1: 08_FPGA_HSIO_B3 (U1.K10), 12_MEM_DDR3 (U10.L7)
DDR3_A2: 08_FPGA_HSIO_B3 (U1.J13), 12_MEM_DDR3 (U10.L3)
DDR3_A3: 08_FPGA_HSIO_B3 (U1.K12), 12_MEM_DDR3 (U10.K2)
DDR3_A4: 08_FPGA_HSIO_B3 (U1.M14), 12_MEM_DDR3 (U10.L8)
DDR3_A5: 08_FPGA_HSIO_B3 (U1.K13), 12_MEM_DDR3 (U10.L2)
DDR3_A6: 08_FPGA_HSIO_B3 (U1.K15), 12_MEM_DDR3 (U10.M8)
DDR3_A7: 08_FPGA_HSIO_B3 (U1.L11), 12_MEM_DDR3 (U10.M2)
DDR3_A8: 08_FPGA_HSIO_B3 (U1.M15), 12_MEM_DDR3 (U10.N8)
DDR3_A9: 08_FPGA_HSIO_B3 (U1.K11), 12_MEM_DDR3 (U10.M3)
DDR3_A10: 08_FPGA_HSIO_B3 (U1.J10), 12_MEM_DDR3 (U10.H7)
DDR3_A11: 08_FPGA_HSIO_B3 (U1.L12), 12_MEM_DDR3 (U10.M7)
DDR3_A12: 08_FPGA_HSIO_B3 (U1.K14), 12_MEM_DDR3 (U10.K7)
DDR3_A13: 08_FPGA_HSIO_B3 (U1.H14), 12_MEM_DDR3 (U10.N3)
DDR3_A14: 08_FPGA_HSIO_B3 (U1.J15), 12_MEM_DDR3 (U10.N7)
DDR3_BA0: 08_FPGA_HSIO_B3 (U1.H15), 12_MEM_DDR3 (U10.J2)
DDR3_BA1: 08_FPGA_HSIO_B3 (U1.L13), 12_MEM_DDR3 (U10.K8)
DDR3_BA2: 08_FPGA_HSIO_B3 (U1.H11), 12_MEM_DDR3 (U10.J3)
DDR3_CAS_N: 08_FPGA_HSIO_B3 (U1.H10), 12_MEM_DDR3 (U10.G3)
DDR3_CK_C: 08_FPGA_HSIO_B3 (U1.F13), 12_MEM_DDR3 (U10.G7)
DDR3_CK_T: 08_FPGA_HSIO_B3 (U1.G13), 12_MEM_DDR3 (U10.F7)
DDR3_CKE: 08_FPGA_HSIO_B3 (U1.J14), 12_MEM_DDR3 (U10.G9)
DDR3_CS_N: 08_FPGA_HSIO_B3 (U1.G14), 12_MEM_DDR3 (U10.H2)
DDR3_DM: 08_FPGA_HSIO_B3 (U1.D13), 12_MEM_DDR3 (U10.B7)
DDR3_DQ0: 08_FPGA_HSIO_B3 (U1.C13), 12_MEM_DDR3 (U10.B3)
DDR3_DQ1: 08_FPGA_HSIO_B3 (U1.C14), 12_MEM_DDR3 (U10.C7)
DDR3_DQ2: 08_FPGA_HSIO_B3 (U1.E15), 12_MEM_DDR3 (U10.C2)
DDR3_DQ3: 08_FPGA_HSIO_B3 (U1.C15), 12_MEM_DDR3 (U10.C8)
DDR3_DQ4: 08_FPGA_HSIO_B3 (U1.F11), 12_MEM_DDR3 (U10.E3)
DDR3_DQ5: 08_FPGA_HSIO_B3 (U1.D14), 12_MEM_DDR3 (U10.E8)
DDR3_DQ6: 08_FPGA_HSIO_B3 (U1.E14), 12_MEM_DDR3 (U10.D2)
DDR3_DQ7: 08_FPGA_HSIO_B3 (U1.D15), 12_MEM_DDR3 (U10.E7)
DDR3_DQS_C: 08_FPGA_HSIO_B3 (U1.E12), 12_MEM_DDR3 (U10.D3)
DDR3_DQS_T: 08_FPGA_HSIO_B3 (U1.F12), 12_MEM_DDR3 (U10.C3)
DDR3_ODT: 08_FPGA_HSIO_B3 (U1.F15), 12_MEM_DDR3 (U10.G1)
DDR3_RAS_N: 08_FPGA_HSIO_B3 (U1.G11), 12_MEM_DDR3 (U10.F3)
DDR3_RESET_N: 08_FPGA_HSIO_B3 (U1.H13), 12_MEM_DDR3 (R55.2 U10.N2)
DDR3_WE_N: 08_FPGA_HSIO_B3 (U1.H12), 12_MEM_DDR3 (U10.H3)
ETH_MGMT_MDC: 05_FPGA_HVIO (R62.1), 13_IO_ETH (U4.13)
ETH_MGMT_MDIO: 05_FPGA_HVIO (U1.R14), 13_IO_ETH (R41.2 U4.14)
ETH_RGMII_RXC: 09_FPGA_HSIO_B4 (U1.P6), 13_IO_ETH (R23.1)
ETH_RGMII_RXCTL: 09_FPGA_HSIO_B4 (U1.R6), 13_IO_ETH (R22.1)
ETH_RGMII_RXD0: 09_FPGA_HSIO_B4 (U1.P7), 13_IO_ETH (R21.1)
ETH_RGMII_RXD1: 09_FPGA_HSIO_B4 (U1.R7), 13_IO_ETH (R20.1)
ETH_RGMII_RXD2: 09_FPGA_HSIO_B4 (U1.P8), 13_IO_ETH (R19.1)
ETH_RGMII_RXD3: 09_FPGA_HSIO_B4 (U1.R8), 13_IO_ETH (R18.1)
ETH_RGMII_TXC: 09_FPGA_HSIO_B4 (R61.1), 13_IO_ETH (U4.20)
ETH_RGMII_TXCTL: 09_FPGA_HSIO_B4 (R60.1), 13_IO_ETH (U4.19)
ETH_RGMII_TXD0: 09_FPGA_HSIO_B4 (R59.1), 13_IO_ETH (U4.18)
ETH_RGMII_TXD1: 09_FPGA_HSIO_B4 (R58.1), 13_IO_ETH (U4.17)
ETH_RGMII_TXD2: 09_FPGA_HSIO_B4 (R57.1), 13_IO_ETH (U4.16)
ETH_RGMII_TXD3: 09_FPGA_HSIO_B4 (R56.1), 13_IO_ETH (U4.15)
FM_CFG_FLASH_HOLD_N: 11_MEM_HYPERRAM_FLASH (R14.1 U3.7), 21_RESET_MISC (U15.13)
FM_FPGA_CDONE: 06_FPGA_HSIO_B1 (U1.L3), 21_RESET_MISC (Q1.1 R107.1)
FM_FT_SPI_EN_N: 15_IO_USB (R114.1 R115.2), 21_RESET_MISC (U15.9 U18.9)
FM_FT_SPI_HLD_N: 15_IO_USB (R112.2), 21_RESET_MISC (U15.4)
FT_SPI_CLK: 15_IO_USB (R109.2), 21_RESET_MISC (U18.3)
FT_SPI_CS_N: 15_IO_USB (U13.15), 21_RESET_MISC (U18.5)
FT_SPI_MISO: 15_IO_USB (U13.14), 21_RESET_MISC (R106.1)
FT_SPI_MOSI: 15_IO_USB (R110.2), 21_RESET_MISC (U18.4)
GPIOB_P_00_PLLIN1: 09_FPGA_HSIO_B4 (U1.R5), 20_CLOCKS (R76.2)
GPIOB_P_17_PLLIN1: 09_FPGA_HSIO_B4 (U1.P11), 20_CLOCKS (R78.2)
GPIOL_11_PLLIN2: 05_FPGA_HVIO (U1.C5), 20_CLOCKS (R75.2 R79.2)
GPIOL_P_00_PLLIN0: 06_FPGA_HSIO_B1 (U1.P2), 20_CLOCKS (R73.2)
GPIOL_P_18_PLLIN0: 06_FPGA_HSIO_B1 (U1.B2), 20_CLOCKS (R68.2 R71.2)
GPIOR_29_PLLIN2: 05_FPGA_HVIO (U1.R13), 20_CLOCKS (R67.2 R70.2)
GPIOT_P_00_PLLIN1: 07_FPGA_HSIO_B2 (U1.E6), 20_CLOCKS (R74.2)
GPIOT_P_17_PLLIN1: 07_FPGA_HSIO_B2 (U1.A11), 20_CLOCKS (R69.2 R72.2)
HYPERRAM_CK_C: 06_FPGA_HSIO_B1 (U1.G2), 11_MEM_HYPERRAM_FLASH (U2.B1)
HYPERRAM_CK_T: 06_FPGA_HSIO_B1 (U1.H2), 11_MEM_HYPERRAM_FLASH (U2.B2)
HYPERRAM_CS_N: 06_FPGA_HSIO_B1 (U1.E3), 11_MEM_HYPERRAM_FLASH (U2.A3)
HYPERRAM_DQ0: 06_FPGA_HSIO_B1 (U1.D1), 11_MEM_HYPERRAM_FLASH (U2.D3)
HYPERRAM_DQ1: 06_FPGA_HSIO_B1 (U1.H1), 11_MEM_HYPERRAM_FLASH (U2.D2)
HYPERRAM_DQ2: 06_FPGA_HSIO_B1 (U1.C1), 11_MEM_HYPERRAM_FLASH (U2.C4)
HYPERRAM_DQ3: 06_FPGA_HSIO_B1 (U1.E1), 11_MEM_HYPERRAM_FLASH (U2.D4)
HYPERRAM_DQ4: 06_FPGA_HSIO_B1 (U1.E2), 11_MEM_HYPERRAM_FLASH (U2.D5)
HYPERRAM_DQ5: 06_FPGA_HSIO_B1 (U1.F2), 11_MEM_HYPERRAM_FLASH (U2.E3)
HYPERRAM_DQ6: 06_FPGA_HSIO_B1 (U1.F1), 11_MEM_HYPERRAM_FLASH (U2.E2)
HYPERRAM_DQ7: 06_FPGA_HSIO_B1 (U1.G1), 11_MEM_HYPERRAM_FLASH (U2.E1)
HYPERRAM_RWDS: 06_FPGA_HSIO_B1 (U1.B1), 11_MEM_HYPERRAM_FLASH (U2.C3)
IRQ_ETH_INTB_N: 05_FPGA_HVIO (U1.N13), 13_IO_ETH (R42.2 U4.31)
JTAG_TCK: 05_FPGA_HVIO (U1.N4), 15_IO_USB (R84.2 R95.2)
JTAG_TDI: 05_FPGA_HVIO (U1.P3), 15_IO_USB (R83.2)
JTAG_TDO: 05_FPGA_HVIO (R82.1), 15_IO_USB (U13.24)
JTAG_TMS: 05_FPGA_HVIO (U1.N3), 15_IO_USB (R85.2)
PWRGD_SYS: 19_PWR_VRS (R97.1 R98.2 R99.2 R100.2), 21_RESET_MISC (Q2.1 U17.3)
RST_ETH_PHYRSTB_N: 05_FPGA_HVIO (U1.N14), 13_IO_ETH (R33.1 U5.2)
RST_FPGA_CRESET_N: 06_FPGA_HSIO_B1 (U1.J5), 21_RESET_MISC (R103.1 SW1.2 U16.4 U17.1)
RST_FT_PLD_RST_N: 15_IO_USB (R111.2), 21_RESET_MISC (U15.3)
RST_HYPERRAM_RST_N: 06_FPGA_HSIO_B1 (U1.F3), 11_MEM_HYPERRAM_FLASH (U2.A4)
SMB_CAM_SCL: 05_FPGA_HVIO (U1.A14), 14_IO_MIPI (J2.20 R65.1)
SMB_CAM_SDA: 05_FPGA_HVIO (U1.B14), 14_IO_MIPI (J2.21 R66.1)
SMB_SYS_SCL: 05_FPGA_HVIO (U1.A3), 20_CLOCKS (R101.1 U11.4)
SMB_SYS_SDA: 05_FPGA_HVIO (U1.B3), 20_CLOCKS (R102.1 U11.5)
UART_RXD: 05_FPGA_HVIO (R93.1), 15_IO_USB (U13.32)
UART_TXD: 05_FPGA_HVIO (U1.R4), 15_IO_USB (R94.2)

## Assembly variants
DEVEFX000001A: not fitted C39 C85 C115 D9 J6 J7 J8 J9 J10 J11 J13 R24 R25 R26 R27 R28 R29 R33 R33 R70 R71 R72 R73 R74 R75 R76 R77 R78 R80 R81 R117